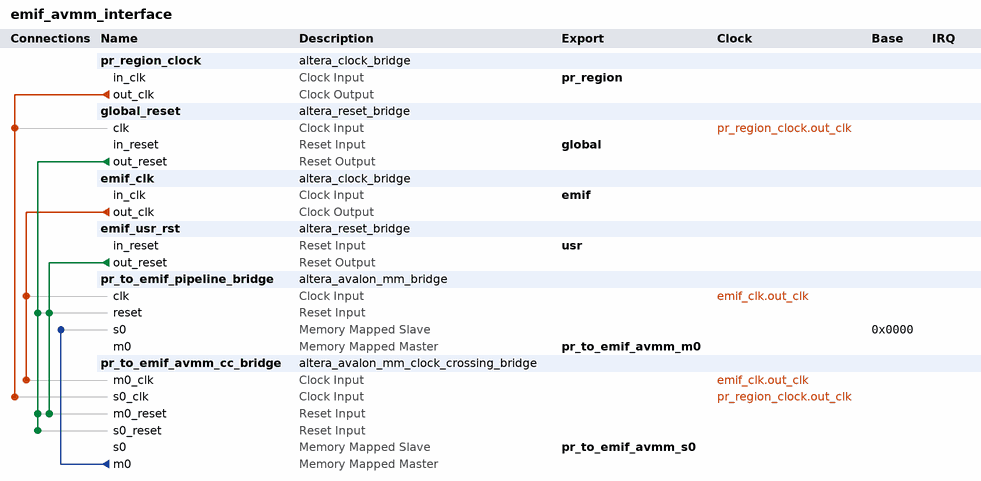
[diagram p0: system contents]
# Platform Designer (Qsys) system emif_avmm_interface, Arria 10 10AX115S2F45I1SG
# Parameters at their usual value, and those the tool derives, are not listed.
package require -exact qsys 1.0
create_system emif_avmm_interface
set_project_property DEVICE_FAMILY {Arria 10}
set_project_property DEVICE 10AX115S2F45I1SG

add_component pr_region_clock ip/emif_avmm_interface/pr_region_clock.ip altera_clock_bridge pr_region_clock 17.1

add_component global_reset ip/emif_avmm_interface/emif_global_reset.ip altera_reset_bridge global_reset 17.1

add_component emif_clk ip/emif_avmm_interface/emif_avmm_interface_clock_in.ip altera_clock_bridge emif_clk 17.1
load_component emif_clk
set_component_parameter_value DERIVED_CLOCK_RATE 0
set_component_parameter_value EXPLICIT_CLOCK_RATE 50000000
save_component

add_component emif_usr_rst ip/emif_avmm_interface/emif_avmm_interface_reset_in.ip altera_reset_bridge emif_usr_rst 17.1
load_component emif_usr_rst
set_component_parameter_value ACTIVE_LOW_RESET 1
set_component_parameter_value SYNCHRONOUS_EDGES none
set_component_parameter_value SYNC_RESET 0
save_component

add_component pr_to_emif_pipeline_bridge ip/emif_avmm_interface/emif_avmm_interface_mm_bridge_0.ip altera_avalon_mm_bridge pr_to_emif_pipeline_bridge 17.1
load_component pr_to_emif_pipeline_bridge
set_component_parameter_value DATA_WIDTH 512
set_component_parameter_value ADDRESS_WIDTH 25
set_component_parameter_value USE_AUTO_ADDRESS_WIDTH 0
set_component_parameter_value ADDRESS_UNITS WORDS
set_component_parameter_value MAX_BURST_SIZE 64
set_component_parameter_value MAX_PENDING_RESPONSES 64
set_component_parameter_value MAX_PENDING_WRITES 0
set_component_parameter_value SYNC_RESET 0
set_component_parameter_value USE_WRITERESPONSE 0
save_component

add_component pr_to_emif_avmm_cc_bridge ip/emif_avmm_interface/emif_avmm_interface_mm_clock_crossing_bridge.ip altera_avalon_mm_clock_crossing_bridge pr_to_emif_avmm_cc_bridge 17.1
load_component pr_to_emif_avmm_cc_bridge
set_component_parameter_value DATA_WIDTH 512
set_component_parameter_value ADDRESS_WIDTH 25
set_component_parameter_value USE_AUTO_ADDRESS_WIDTH 0
set_component_parameter_value ADDRESS_UNITS WORDS
set_component_parameter_value MAX_BURST_SIZE 64
set_component_parameter_value COMMAND_FIFO_DEPTH 128
set_component_parameter_value RESPONSE_FIFO_DEPTH 128
set_component_parameter_value MASTER_SYNC_DEPTH 2
set_component_parameter_value SLAVE_SYNC_DEPTH 2
set_component_parameter_value SYNC_RESET 0
save_component

# connections
add_connection emif_clk.out_clk pr_to_emif_avmm_cc_bridge.m0_clk clock
add_connection emif_clk.out_clk pr_to_emif_pipeline_bridge.clk clock
add_connection pr_region_clock.out_clk global_reset.clk clock
add_connection pr_region_clock.out_clk pr_to_emif_avmm_cc_bridge.s0_clk clock
add_connection emif_usr_rst.out_reset pr_to_emif_avmm_cc_bridge.m0_reset reset
add_connection emif_usr_rst.out_reset pr_to_emif_pipeline_bridge.reset reset
add_connection global_reset.out_reset pr_to_emif_avmm_cc_bridge.m0_reset reset
add_connection global_reset.out_reset pr_to_emif_avmm_cc_bridge.s0_reset reset
add_connection global_reset.out_reset pr_to_emif_pipeline_bridge.reset reset
add_connection pr_to_emif_avmm_cc_bridge.m0 pr_to_emif_pipeline_bridge.s0 avalon
set_connection_parameter_value pr_to_emif_avmm_cc_bridge.m0/pr_to_emif_pipeline_bridge.s0 baseAddress 0x0000

# exported interfaces
add_interface emif clock sink
set_interface_property emif EXPORT_OF emif_clk.in_clk
add_interface global reset sink
set_interface_property global EXPORT_OF global_reset.in_reset
add_interface pr_region clock sink
set_interface_property pr_region EXPORT_OF pr_region_clock.in_clk
add_interface pr_to_emif_avmm_m0 avalon master
set_interface_property pr_to_emif_avmm_m0 EXPORT_OF pr_to_emif_pipeline_bridge.m0
add_interface pr_to_emif_avmm_s0 avalon slave
set_interface_property pr_to_emif_avmm_s0 EXPORT_OF pr_to_emif_avmm_cc_bridge.s0
add_interface usr reset sink
set_interface_property usr EXPORT_OF emif_usr_rst.in_reset

save_system emif_avmm_interface.qsys
